# Altium project BRNOTONE DUALFORGE DF-1.PrjPcb
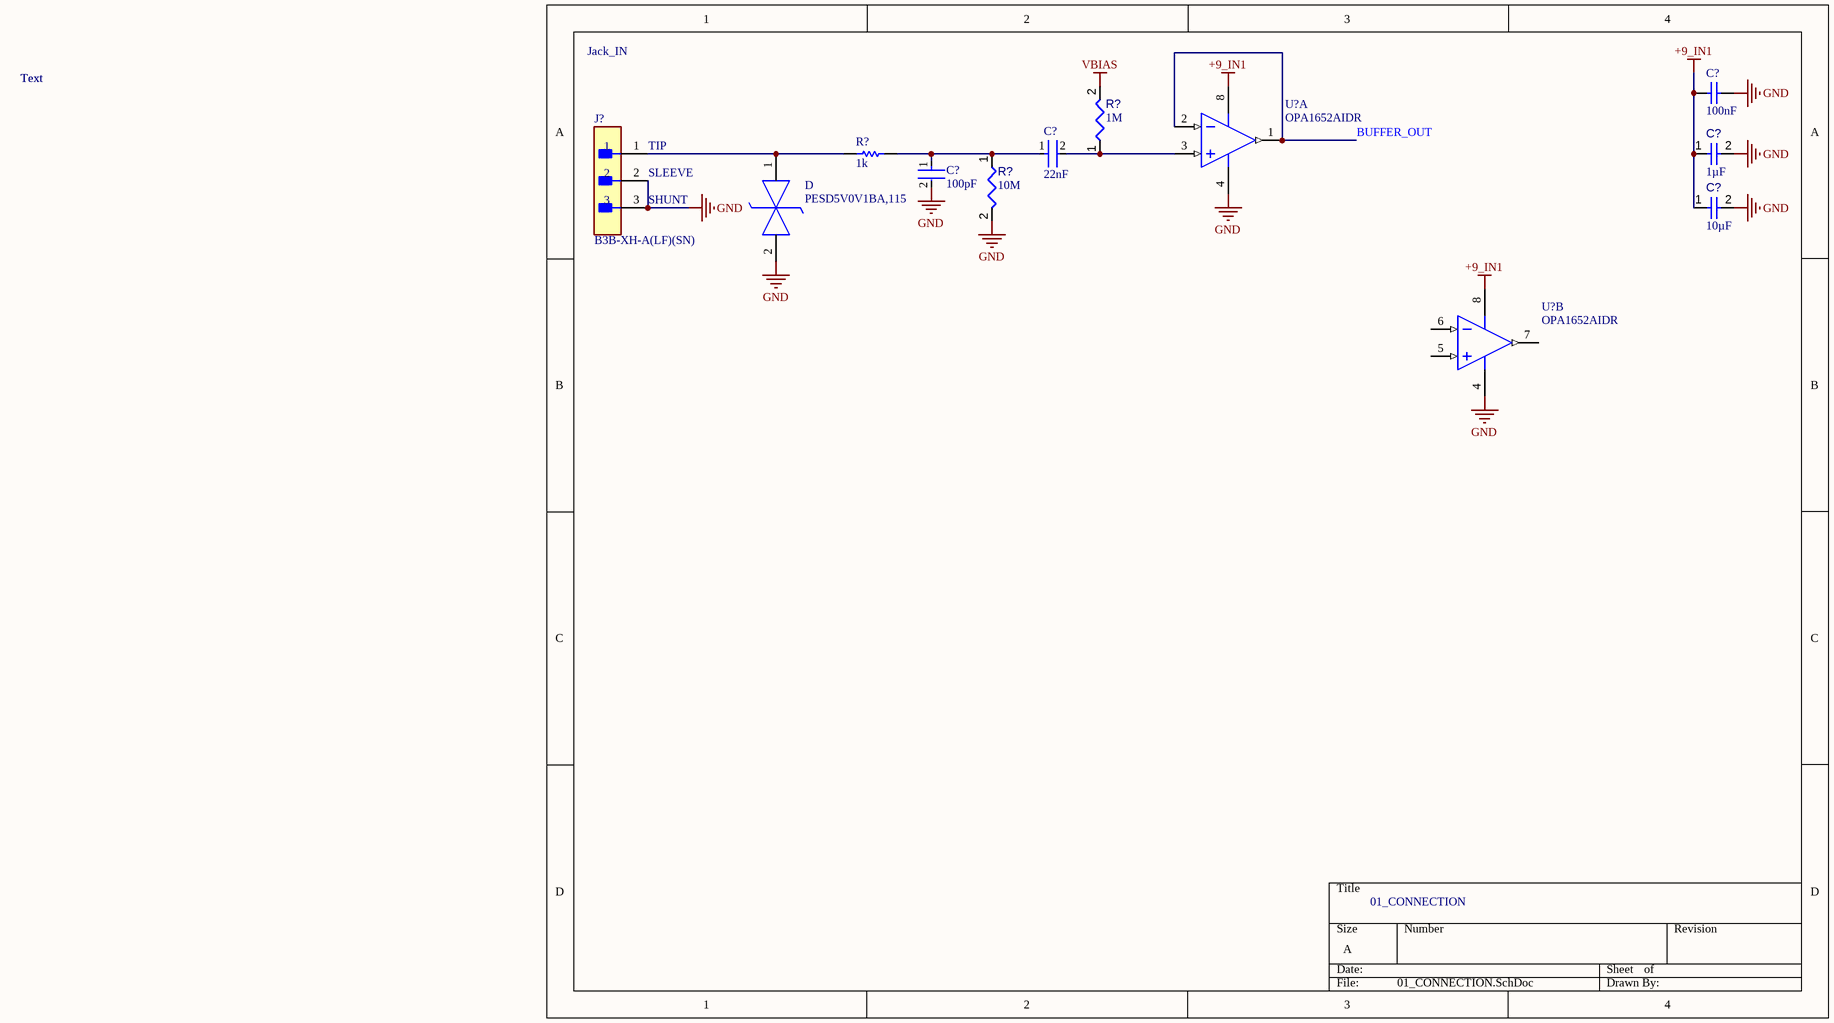
[diagram p0: 01_CONNECTION.SchDoc]
1 sheet, 12 parts. Net scope: global (net labels, ports and power ports of the same name join across sheets).

## Sheet 01_CONNECTION.SchDoc
size A; SheetNumber: 1; SheetTotal: 2

### Parts
(Parts that share a designator on the sheet are numbered #1, #2 ... from top to bottom, then left to right.)
C?#1  value 100nF  [KEMT-1206-2_N]  (hidden comment: C1206C104K5RACTU)
C?#2  value 22nF  [FP-C1206C-EB-MFG]  (hidden comment: C1206C223J5GACTU)
C?#3  value 1µF  [CAPC3216X180X20ML20]  (hidden comment: Capacitor 1 uF +/- 10% 25 V 1206)
C?#4  value 100pF  [FP-C1206C-EB-MFG]  (hidden comment: C1206C101J5GACTU)
C?#5  value 10µF  [CAPC3216X180X50NL20T25]  (hidden comment: Capacitor 10 uF +/- 10% 16 V 1206)
D  PESD5V0V1BA,115  [PESD5V0V1BA,115-Footprint-1]
J?  B3B-XH-A(LF)(SN)  [FP-B3B-XH-A_LF_SN-MFG]
R?#1  value 1k  [RESC3116X70X50ML13T20]  (hidden comment: Resistor 1k +/-1% 1206 250 mW)
R?#2  value 10M  [RC1206FR-0710ML-Footprint-1]  (hidden comment: RC1206FR-0710ML)
R?#3  value 1M  [RC1206FR-071ML-Footprint-1]  (hidden comment: RC1206FR-071ML)
U?#1  OPA1652AIDR  [D0008A_N]  (part A of 2)
U?#2  OPA1652AIDR  [D0008A_N]  (part B of 2)

### Nets
+9_IN1: C?#1.2 C?#3.1 C?#5.1 U?#1.8(V+) U?#2.8(V+)
GND: C?#1.1 C?#3.2 C?#4.2 C?#5.2 D.2(K2) J?.2 J?.3 R?#2.2 U?#1.4(V-) U?#2.4(V-)
VBIAS: R?#3.2
BUFFER_OUT: U?#1.1(OUT_A) U?#1.2(IN_A-)
NetC?#2_1: C?#2.1 C?#4.1 R?#1.2 R?#2.1
NetC?#2_2: C?#2.2 R?#3.1 U?#1.3(IN_A+)
NetD_1: D.1(K1) J?.1 R?#1.1

Not connected (* = marked no-connect by the designer): U?#2 5(IN_B+) 6(IN_B-) 7(OUT_B)

### Notes on the sheet
- Text
- Jack_IN
- (near J?) TIP
- (near J?) SLEEVE
- (near J?) SHUNT
- 01_CONNECTION

### Library data of the parts
C?#1 = CMP-001-00104-1: Multilayer Ceramic Capacitors MLCC - SMD/SMT 50V 0.1uF X7R 1206 10%; Case/Package: 1206; Max Operating Temperature: 125°C; Pins: 2; Min Operating Temperature: -55°C; Mounting Technology: Surface Mount; Voltage Rating: 50V; Tolerance: 10%
C?#2 = CMP-001-00103-1: 1206 (3216METRIC) Ceramic Capacitor SMD Comm C0G 50V 0.022MUF ±5% C0G NP0; Pins: 2; Min Operating Temperature: -55°C; Tolerance: 5%; Voltage Rating: 50V; Max Operating Temperature: 125°C; Case/Package: 1206; Mounting Technology: Surface Mount
C?#3 = CMP-001-00006-6: Chip Capacitor, 1 uF, +/- 10%, 25 V, 1206 (3216 Metric); Capacitor Type: Ceramic; Voltage Rating: 25V; Tolerance: 10%; Min Operating Temperature: -55°C; Pins: 2; Case/Package: 1206; Max Operating Temperature: 125°C; Mounting Technology: SM; RoHS Compliant: True
C?#4 = CMP-001-00102-1: Multilayer Ceramic Capacitor, 100 pF, 50 V, ± 5%, C0G (NP0), 1206 [3216 Metric]; Voltage Rating: 50V; Min Operating Temperature: -55°C; Tolerance: 5%; Mounting Technology: Surface Mount; Case/Package: 1206; Max Operating Temperature: 125°C; Pins: 2
C?#5 = CMP-001-00016-6: Chip Capacitor, 10 uF, +/- 10%, 16 V, 1206 (3216 Metric); Capacitor Type: Ceramic; Voltage Rating: 16V; Tolerance: 10%; Min Operating Temperature: -55°C; Pins: 2; Mounting Technology: SM; Case/Package: 1206; Max Operating Temperature: 125°C; RoHS Compliant: True
D = CMP-004-00039-1: ESD protection diodes / TVS diodes; NEXPERIA; PESD5V0V1BA, 115; 12.5 V; 4.8 A; 5 V; 5.8 V; Max Operating Temperature: 150°C; Mounting Technology: Surface Mount; Pins: 2; Min Operating Temperature: -55°C
J? = CMP-002-00074-1: Connector Header, XH Series, 3 Position, 2.50mm, Through Hole, Press-Fit, Solder, Natural; Voltage Rating: 250V; Gender: Male; Connector Type: Male Pin; Max Current Rating: 3A; Pins: 3; Min Operating Temperature: -25°C; Mounting Technology: Through Hole; Max Operating Temperature: 85°C
R?#1 = CMP-009-00011-5: Chip Resistor, 1 KOhm, +/- 1%, 0.25 W, -55 to 155 degC, 1206 (3216 Metric); Voltage Rating: 200V; Power: 250mW; Max Operating Temperature: 155°C; Mounting Technology: SM; Tolerance: 1%; Case/Package: 1206; RoHS Compliant: True; Min Operating Temperature: -55°C; Pins: 2
R?#2 = CMP-009-00185-1: 250mW Thick Film Resistors 200V ±100ppm/℃ ±1% 10MΩ 1206 Chip Resistor - Surface Mount ROHS; Voltage Rating: 200V; Case/Package: 1206; Tolerance: 1%; Min Operating Temperature: -55°C; Pins: 2; Mounting Technology: Surface Mount; Max Operating Temperature: 155°C
R?#3 = CMP-009-00186-1: Res Thick Film 1206 1M Ohm 1% 0.25W(1/4W) ±100ppm/C Pad SMD T/R; Voltage Rating: 200V; Tolerance: 1%; Max Operating Temperature: 155°C; Case/Package: 1206; Mounting Technology: Surface Mount; Min Operating Temperature: -55°C; Pins: 2
U?#1 U?#2 = CMP-014-00008-1: IC AUDIO 2 CIRCUIT 8SOIC Audio Amplifier 2 Circuit Rail-to-Rail 8-SOIC; Min Supply Voltage: 4.5V; Max Supply Voltage: 36V; Nominal Gain Bandwidth Product: 18MHz; Pins: 8; Max Operating Temperature: 85°C; Min Operating Temperature: -40°C; Case/Package: SOIC